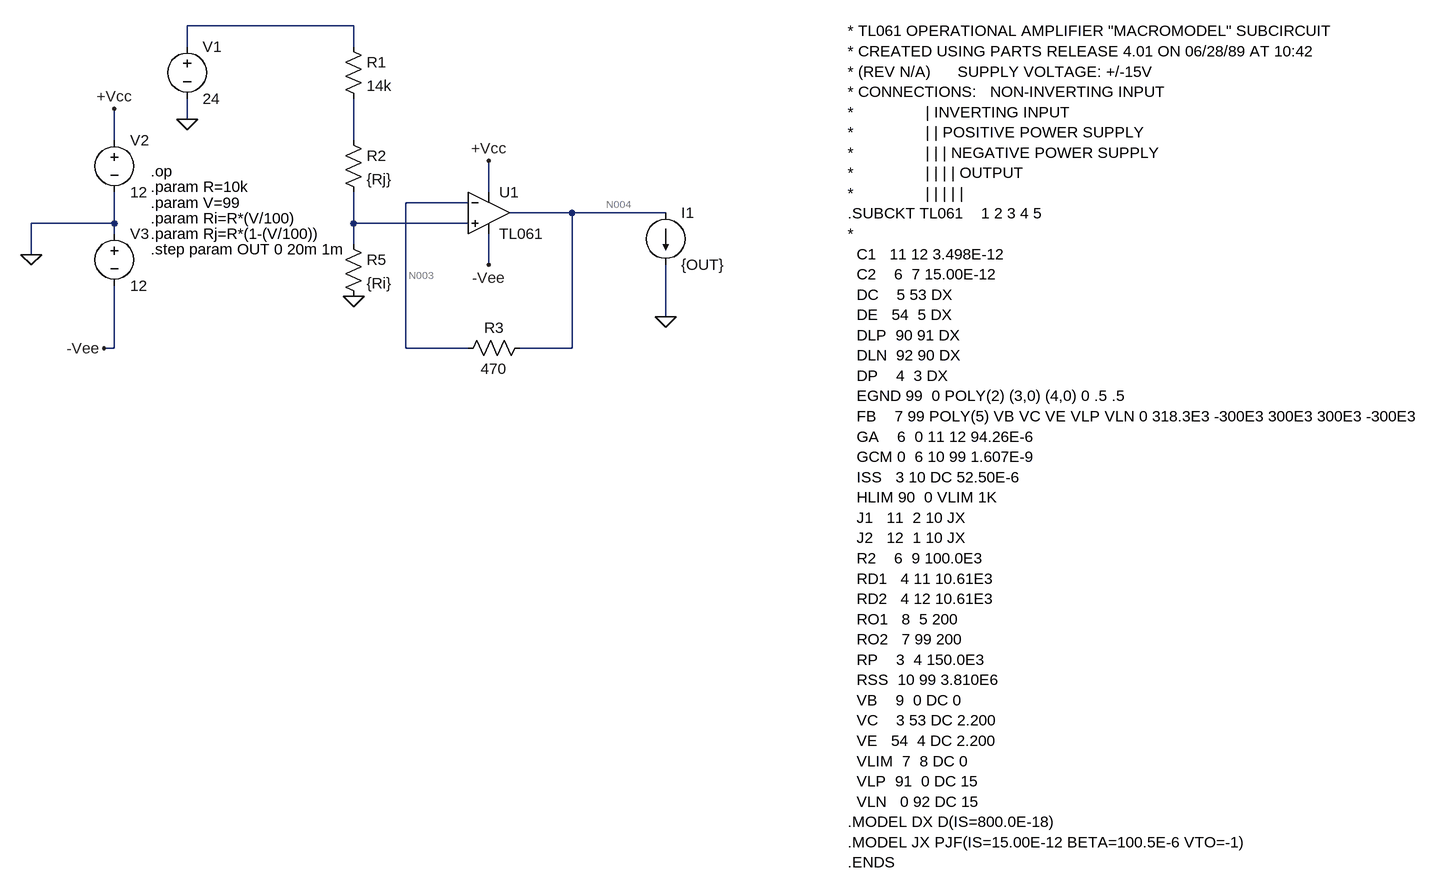
[diagram p0: schematic z1_current.asc]
z1_current.asc, the LTspice schematic file:
Version 4
SHEET 1 3900 1348
WIRE -16 176 -272 176
WIRE -272 208 -272 176
WIRE -16 208 -16 176
WIRE -272 320 -272 288
WIRE -384 352 -384 304
WIRE -16 352 -16 288
WIRE 192 432 192 384
WIRE 160 448 64 448
WIRE 320 464 224 464
WIRE 464 464 320 464
WIRE -384 480 -384 432
WIRE -384 480 -512 480
WIRE -16 480 -16 432
WIRE 160 480 -16 480
WIRE -384 496 -384 480
WIRE -16 512 -16 480
WIRE -512 528 -512 480
WIRE 192 544 192 496
WIRE 464 624 464 544
WIRE -384 672 -384 576
WIRE -384 672 -400 672
WIRE 64 672 64 448
WIRE 160 672 64 672
WIRE 320 672 320 464
WIRE 320 672 240 672
FLAG -272 320 0
FLAG 464 624 0
FLAG -384 304 +Vcc
FLAG 192 384 +Vcc
FLAG 192 544 -Vee
FLAG -512 528 0
FLAG -400 672 -Vee
FLAG -16 592 0
SYMBOL res -32 192 R0
SYMATTR InstName R1
SYMATTR Value 14k
SYMBOL res 256 656 R90
WINDOW 0 0 56 VBottom 2
WINDOW 3 32 56 VTop 2
SYMATTR InstName R3
SYMATTR Value 470
SYMBOL voltage -272 192 R0
WINDOW 123 0 0 Left 0
WINDOW 39 0 0 Left 0
SYMATTR InstName V1
SYMATTR Value 24
SYMBOL OpAmps\\opamp2 192 400 R0
SYMATTR InstName U1
SYMATTR Value TL061
SYMBOL voltage -384 336 R0
WINDOW 123 0 0 Left 0
WINDOW 39 0 0 Left 0
SYMATTR InstName V2
SYMATTR Value 12
SYMBOL voltage -384 480 R0
WINDOW 123 0 0 Left 0
WINDOW 39 0 0 Left 0
SYMATTR InstName V3
SYMATTR Value 12
SYMBOL res -32 336 R0
SYMATTR InstName R2
SYMATTR Value {Rj}
SYMBOL res -32 496 R0
SYMATTR InstName R5
SYMATTR Value {Ri}
SYMBOL current 464 464 R0
WINDOW 123 0 0 Left 0
WINDOW 39 0 0 Left 0
SYMATTR InstName I1
SYMATTR Value {OUT}
TEXT 744 184 Left 2 !* TL061 OPERATIONAL AMPLIFIER "MACROMODEL" SUBCIRCUIT\n* CREATED USING PARTS RELEASE 4.01 ON 06/28/89 AT 10:42\n* (REV N/A)      SUPPLY VOLTAGE: +/-15V\n* CONNECTIONS:   NON-INVERTING INPUT\n*                | INVERTING INPUT\n*                | | POSITIVE POWER SUPPLY\n*                | | | NEGATIVE POWER SUPPLY\n*                | | | | OUTPUT\n*                | | | | |\n.SUBCKT TL061    1 2 3 4 5\n*\n  C1   11 12 3.498E-12\n  C2    6  7 15.00E-12\n  DC    5 53 DX\n  DE   54  5 DX\n  DLP  90 91 DX\n  DLN  92 90 DX\n  DP    4  3 DX\n  EGND 99  0 POLY(2) (3,0) (4,0) 0 .5 .5\n  FB    7 99 POLY(5) VB VC VE VLP VLN 0 318.3E3 -300E3 300E3 300E3 -300E3\n  GA    6  0 11 12 94.26E-6\n  GCM 0  6 10 99 1.607E-9\n  ISS   3 10 DC 52.50E-6\n  HLIM 90  0 VLIM 1K\n  J1   11  2 10 JX\n  J2   12  1 10 JX\n  R2    6  9 100.0E3\n  RD1   4 11 10.61E3\n  RD2   4 12 10.61E3\n  RO1   8  5 200\n  RO2   7 99 200\n  RP    3  4 150.0E3\n  RSS  10 99 3.810E6\n  VB    9  0 DC 0\n  VC    3 53 DC 2.200\n  VE   54  4 DC 2.200\n  VLIM  7  8 DC 0\n  VLP  91  0 DC 15\n  VLN   0 92 DC 15\n.MODEL DX D(IS=800.0E-18)\n.MODEL JX PJF(IS=15.00E-12 BETA=100.5E-6 VTO=-1)\n.ENDS
TEXT -328 448 Left 2 !.param V=99
TEXT -328 400 Left 2 !.op
TEXT -328 424 Left 2 !.param R=10k
TEXT -328 472 Left 2 !.param Ri=R*(V/100)
TEXT -328 496 Left 2 !.param Rj=R*(1-(V/100))
TEXT -328 520 Left 2 !.step param OUT 0 20m 1m

The netlist it stands for:
* z1_current.asc
R1 N001 N002 14k
R3 N004 N003 470
V1 N001 0 24
XU1 N005 N003 +Vcc -Vee N004 TL061  ; pins In+ In- V+ V- OUT
V2 +Vcc 0 12
V3 0 -Vee 12
R2 N002 N005 {Rj}
R5 N005 0 {Ri}
I1 N004 0 {OUT}
* TL061 OPERATIONAL AMPLIFIER "MACROMODEL" SUBCIRCUIT
* CREATED USING PARTS RELEASE 4.01 ON 06/28/89 AT 10:42
* (REV N/A)      SUPPLY VOLTAGE: +/-15V
* CONNECTIONS:   NON-INVERTING INPUT
*                | INVERTING INPUT
*                | | POSITIVE POWER SUPPLY
*                | | | NEGATIVE POWER SUPPLY
*                | | | | OUTPUT
*                | | | | |
.SUBCKT TL061    1 2 3 4 5
*
  C1   11 12 3.498E-12
  C2    6  7 15.00E-12
  DC    5 53 DX
  DE   54  5 DX
  DLP  90 91 DX
  DLN  92 90 DX
  DP    4  3 DX
  EGND 99  0 POLY(2) (3,0) (4,0) 0 .5 .5
  FB    7 99 POLY(5) VB VC VE VLP VLN 0 318.3E3 -300E3 300E3 300E3 -300E3
  GA    6  0 11 12 94.26E-6
  GCM 0  6 10 99 1.607E-9
  ISS   3 10 DC 52.50E-6
  HLIM 90  0 VLIM 1K
  J1   11  2 10 JX
  J2   12  1 10 JX
  R2    6  9 100.0E3
  RD1   4 11 10.61E3
  RD2   4 12 10.61E3
  RO1   8  5 200
  RO2   7 99 200
  RP    3  4 150.0E3
  RSS  10 99 3.810E6
  VB    9  0 DC 0
  VC    3 53 DC 2.200
  VE   54  4 DC 2.200
  VLIM  7  8 DC 0
  VLP  91  0 DC 15
  VLN   0 92 DC 15
.MODEL DX D(IS=800.0E-18)
.MODEL JX PJF(IS=15.00E-12 BETA=100.5E-6 VTO=-1)
.ENDS
.param V=99
.op
.param R=10k
.param Ri=R*(V/100)
.param Rj=R*(1-(V/100))
.step param OUT 0 20m 1m
.backanno
.end

* Results of the author's LTspice run, read from the files saved beside the schematic
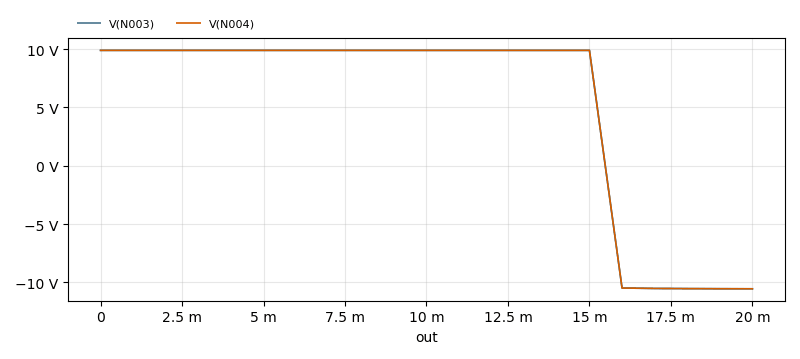
[diagram p1: Operating Point of z1_current.asc, plotted from the saved traces]
* Operating Point, 1 run:
*   V(N003): 9.898 V at out=0, -10.56 V at out=20 m, min -10.56 V, max 9.898 V
*   V(N004): 9.898 V at out=0, -10.56 V at out=20 m, min -10.56 V, max 9.898 V